# EAGLE design IB_WIFI_V2 (EAGLE 6.4)
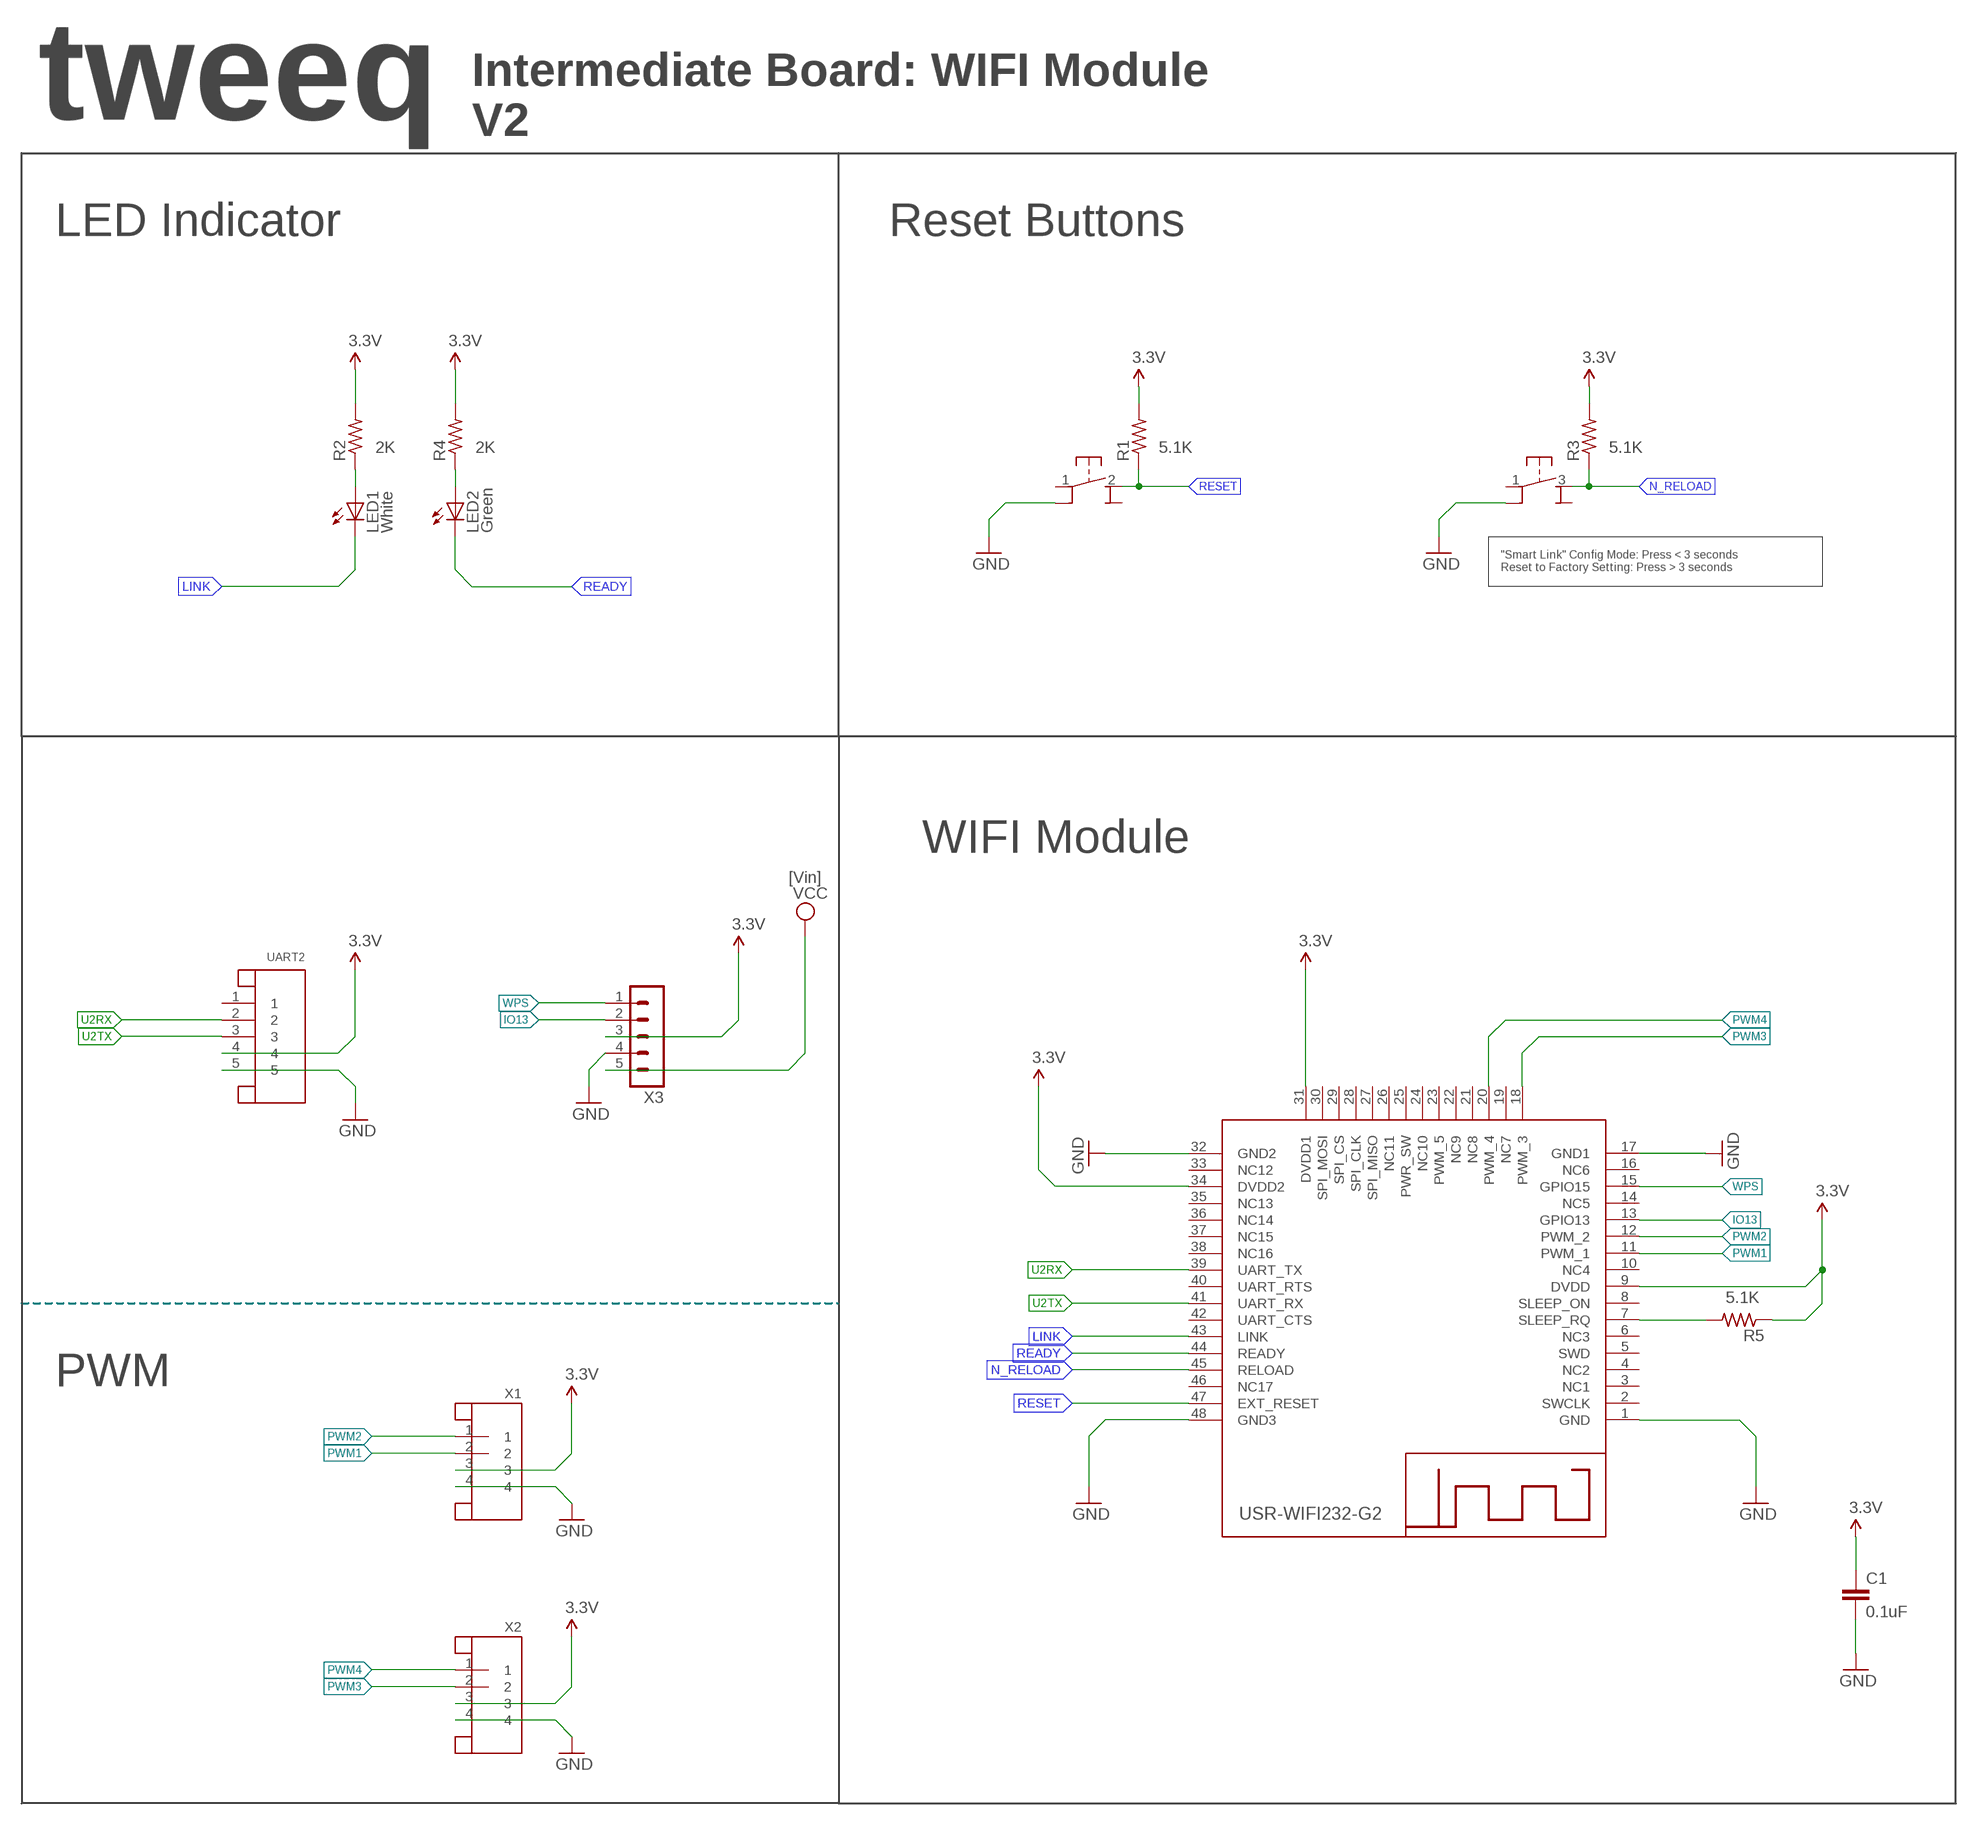
[diagram p0: schematic, sheet 1, part 1 of 2]
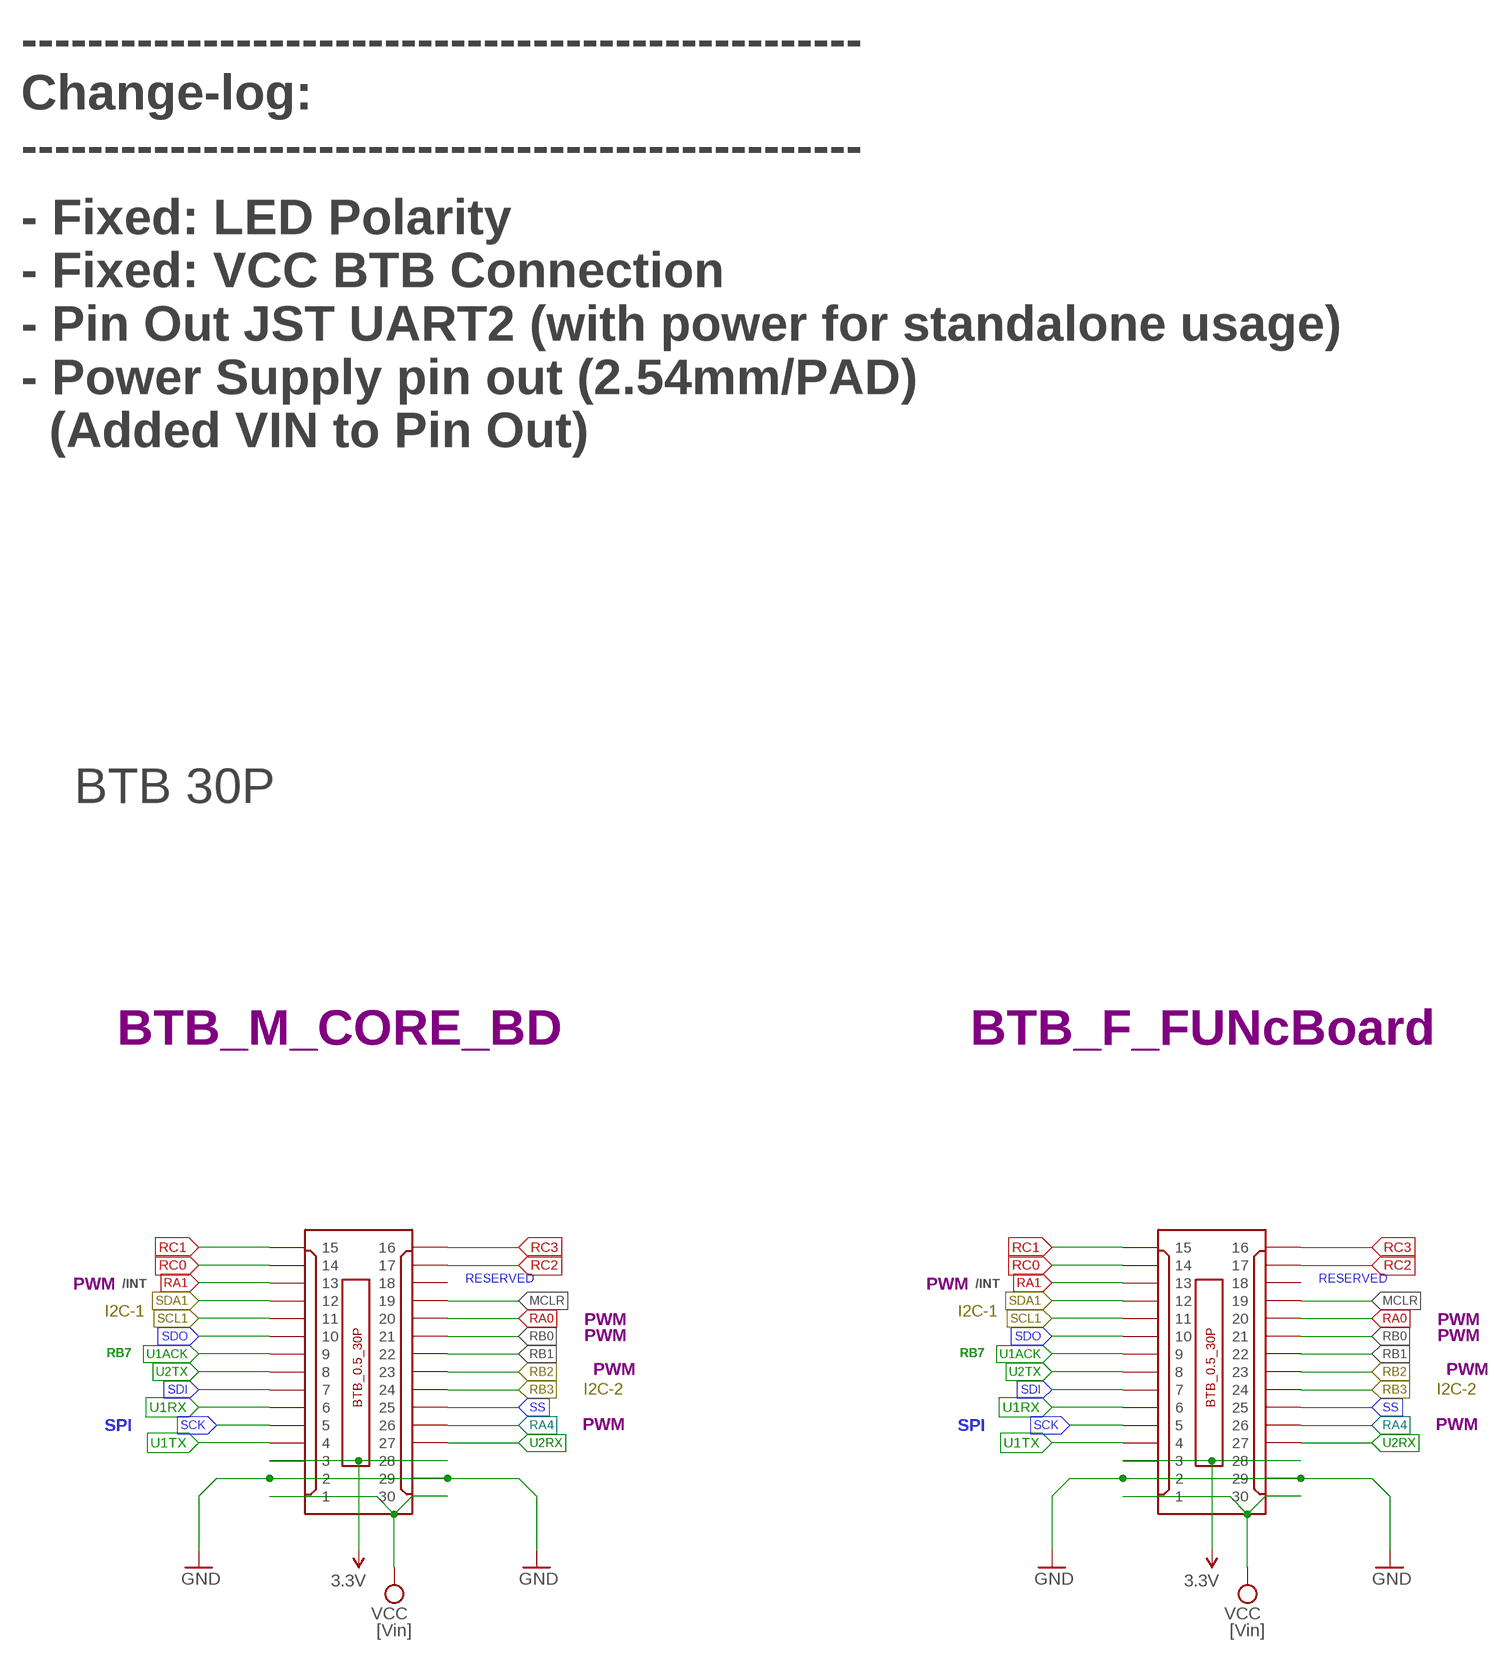
[diagram p1: schematic, sheet 1, part 2 of 2]

## Parts
C1  0.1uF  C-EUC0603  [C0603]
LED1  White  LEDCHIPLED_0805  [CHIPLED_0805]
LED2  Green  LEDCHIPLED_0805  [CHIPLED_0805]
R1  5.1K  R-US_R0603  [R0603]
R2  2K  R-US_R0603  [R0603]
R3  5.1K  R-US_R0603  [R0603]
R4  2K  R-US_R0603  [R0603]
R5  5.1K  R-US_R0603  [R0603]
U$1  BTB_CONN_30P/M  [BTB0.5-30M-3.0G]
U$3  BTB_CONN_30P/F  [BTB0.5-30F-3.0G]
U$4  PB_MICRO_SMT  [PB_SMT_3.5X3X2]
U$5  PB_MICRO_SMTRIGHTANGLE  [PB_SMT_90D6.2X4.6]
UART2  JST-5PINSH  [SH1.0-5PIN]
USR-WIFI232-G2  USR-WIFI232-G2  [USR-WIFI232-G]
X1  JST-4PINSH  [SH1.0-4PIN]
X2  JST-4PINSH  [SH1.0-4PIN]
X3  M05-1PAD  [1X05_PAD]

## Nets
3.3V: C1.1 R1.2 R2.2 R3.2 R4.2 R5.1 U$1.3 U$1.28 U$3.3 U$3.28 UART2.4 USR-WIFI232-G2.9(DVDD) USR-WIFI232-G2.31(DVDD1) USR-WIFI232-G2.34(DVDD2) X1.3 X2.3 X3.3
GND: C1.2 U$1.2 U$1.29 U$3.2 U$3.29 U$4.2(1A) U$5.1A UART2.5 USR-WIFI232-G2.1(GND) USR-WIFI232-G2.17(GND1) USR-WIFI232-G2.32(GND2) USR-WIFI232-G2.48(GND3) X1.4 X2.4 X3.4
IO13: USR-WIFI232-G2.13(GPIO13) X3.2
LINK: LED1.C USR-WIFI232-G2.43(LINK)
MCLR: U$1.19 U$3.19
N$1: LED1.A R2.1
N$2: LED2.A R4.1
N_RELOAD: R3.1 U$4.3 USR-WIFI232-G2.45(RELOAD)
PWM1: USR-WIFI232-G2.11(PWM_1) X1.2
PWM2: USR-WIFI232-G2.12(PWM_2) X1.1
PWM3: USR-WIFI232-G2.18(PWM_3) X2.2
PWM4: USR-WIFI232-G2.20(PWM_4) X2.1
RA0: U$1.20 U$3.20
RA1: U$1.13 U$3.13
RA4: U$1.26 U$3.26
RB0: U$1.21 U$3.21
RB1: U$1.22 U$3.22
RB2: U$1.23 U$3.23
RB3: U$1.24 U$3.24
RC0: U$1.14 U$3.14
RC1: U$1.15 U$3.15
RC2: U$1.17 U$3.17
RC3: U$1.16 U$3.16
READY: LED2.C USR-WIFI232-G2.44(READY)
RESET: R1.1 U$5.2 USR-WIFI232-G2.47(EXT_RESET)
SCK: U$1.5 U$3.5
SCL1: U$1.11 U$3.11
SDA1: U$1.12 U$3.12
SDI: U$1.7 U$3.7
SDO: U$1.10 U$3.10
SLEEP_RQ: R5.2 USR-WIFI232-G2.7(SLEEP_RQ)
SS: U$1.25 U$3.25
U1ACK: U$1.9 U$3.9
U1RX: U$1.6 U$3.6
U1TX: U$1.4 U$3.4
U2RX: U$1.27 U$3.27 UART2.2 USR-WIFI232-G2.39(UART_TX)
U2TX: U$1.8 U$3.8 UART2.3 USR-WIFI232-G2.41(UART_RX)
VCC: U$1.1 U$1.30 U$3.1 U$3.30 X3.5
WPS: USR-WIFI232-G2.15(GPIO15) X3.1
Unconnected: U$1.18 U$3.18 U$4.1 U$4.4(2A) U$5.1 U$5.2A UART2.1 USR-WIFI232-G2.2(SWCLK) USR-WIFI232-G2.3(NC1) USR-WIFI232-G2.4(NC2) USR-WIFI232-G2.5(SWD) USR-WIFI232-G2.6(NC3) USR-WIFI232-G2.8(SLEEP_ON) USR-WIFI232-G2.10(NC4) USR-WIFI232-G2.14(NC5) USR-WIFI232-G2.16(NC6) USR-WIFI232-G2.19(NC7) USR-WIFI232-G2.21(NC8) USR-WIFI232-G2.22(NC9) USR-WIFI232-G2.23(PWM_5) USR-WIFI232-G2.24(NC10) USR-WIFI232-G2.25(PWR_SW) USR-WIFI232-G2.26(NC11) USR-WIFI232-G2.27(SPI_MISO) USR-WIFI232-G2.28(SPI_CLK) USR-WIFI232-G2.29(SPI_CS) USR-WIFI232-G2.30(SPI_MOSI) USR-WIFI232-G2.33(NC12) USR-WIFI232-G2.35(NC13) USR-WIFI232-G2.36(NC14) USR-WIFI232-G2.37(NC15) USR-WIFI232-G2.38(NC16) USR-WIFI232-G2.40(UART_RTS) USR-WIFI232-G2.42(UART_CTS) USR-WIFI232-G2.46(NC17)

## Notes on the sheet
- Intermediate Board: WIFI Module
- tweeq
- V2
- LED Indicator | Reset Buttons
- ---------------------------------------------------
  Change-log:
  ---------------------------------------------------
- - Fixed: LED Polarity
  - Fixed: VCC BTB Connection
  - Pin Out JST UART2 (with power for standalone usage)
  - Power Supply pin out (2.54mm/PAD)
    (Added VIN to Pin Out)
- "Smart Link" Config Mode: Press < 3 seconds 
  Reset to Factory Setting: Press > 3 seconds
- WIFI Module
- BTB 30P
- [Vin]
- BTB_M_CORE_BD | BTB_F_FUNcBoard
- PWM | /INT | PWM | /INT
- RESERVED | RESERVED
- I2C-1 | I2C-1
- PWM | PWM
- PWM | PWM
- RB7 | RB7
- PWM
- PWM | PWM
- I2C-2 | I2C-2
- SPI | SPI
- PWM | PWM
- [Vin] | [Vin]

## Library data of the parts
C1 = AISCube:C-EU: CAPACITOR, European symbol
LED1 LED2 = AISCube:LED: LED OSRAM: - CHIPLED LG R971, LG N971, LY N971, LG Q971, LY Q971, LO R971, LY R971 LH N974, LH R974 LS Q976, LO Q976, LY Q976 LO Q996 - Hyper CHIPLED LW Q18S LB Q993, LB Q99A, LB R99A - SideLED LS A670, LO A670, LY A670, LG A670, LP A670 LB A673, LV A673, LT A673, LW A673 LH A674 LY A675 LS A676, LA A676, LO A676, LY A676, LW A676 LS A679, LY A679, LG A679 - Hyper Micro SIDELED® LS Y876, LA Y876, LO Y876, LY Y876 LT Y87S - SmartLED LW L88C, LW L88S LB L89C, LB L89S, LG L890 LS L89K, LO L89K, LY L89K LS L896, LA L896, LO L896, LY L896 - TOPLED LS T670, LO T670, LY T670, LG T670, LP T670 LSG T670, LSP T670, LSY T670, LOP T670, LYG T670 LG T671, LOG T671, LSG T671 LB T673, LV T673, LT T673, LW T673 LH T674 LS T676, LA T676, LO T676, LY T676, LB T676, LH T676, LSB T676, LW T676 LB T67C, LV T67C, LT T67C, LS T67K, LO T67K, LY T67K, LW E67C LS E67B, LA E67B, LO E67B, LY E67B, LB E67C, LV E67C, LT E67C LW T67C LS T679, LY T679, LG T679 LS T770, LO T770, LY T770, LG T770, LP T770 LB T773, LV T773, LT T773, LW T773 LH T774 LS E675, LA E675, LY E675, LS T675 LS T776, LA T776, LO T776, LY T776, LB T776 LHGB T686 LT T68C, LB T68C - Hyper Mini TOPLED® LB M676 - Mini TOPLED Santana® LG M470 LS M47K, LO M47K, LY M47K Source: http://www.osram.convergy.de/
R1-R5 = AISCube:R-US_: RESISTOR, American symbol
U$1 U$3 = AISCube:BTB_CONN_30P: Board to Board Connector SMD 0.5mm Pitch 30 way - Dual Side (2x15) Total Mating height: 3.0mm
U$4 U$5 = AISCube:PB_MICRO_SMT
UART2 = AISCube:JST-5PIN: JST 5 Pin
USR-WIFI232-G2 = AISCube:USR-WIFI232-G2: USR-WIFI232-G2 Low Power UART to WiFi Module FCC/CE Certified Single 3.3V Power Supply Support Internal/External Antenna Dimension: 23.1 x 32.8 x 2.7mm
X1 X2 = AISCube:JST-4PIN: JST 4 Pin
X3 = AISCube:M05-1: PIN HEADER Standard 0.1" header pin 5 pins - 1 way

## Board
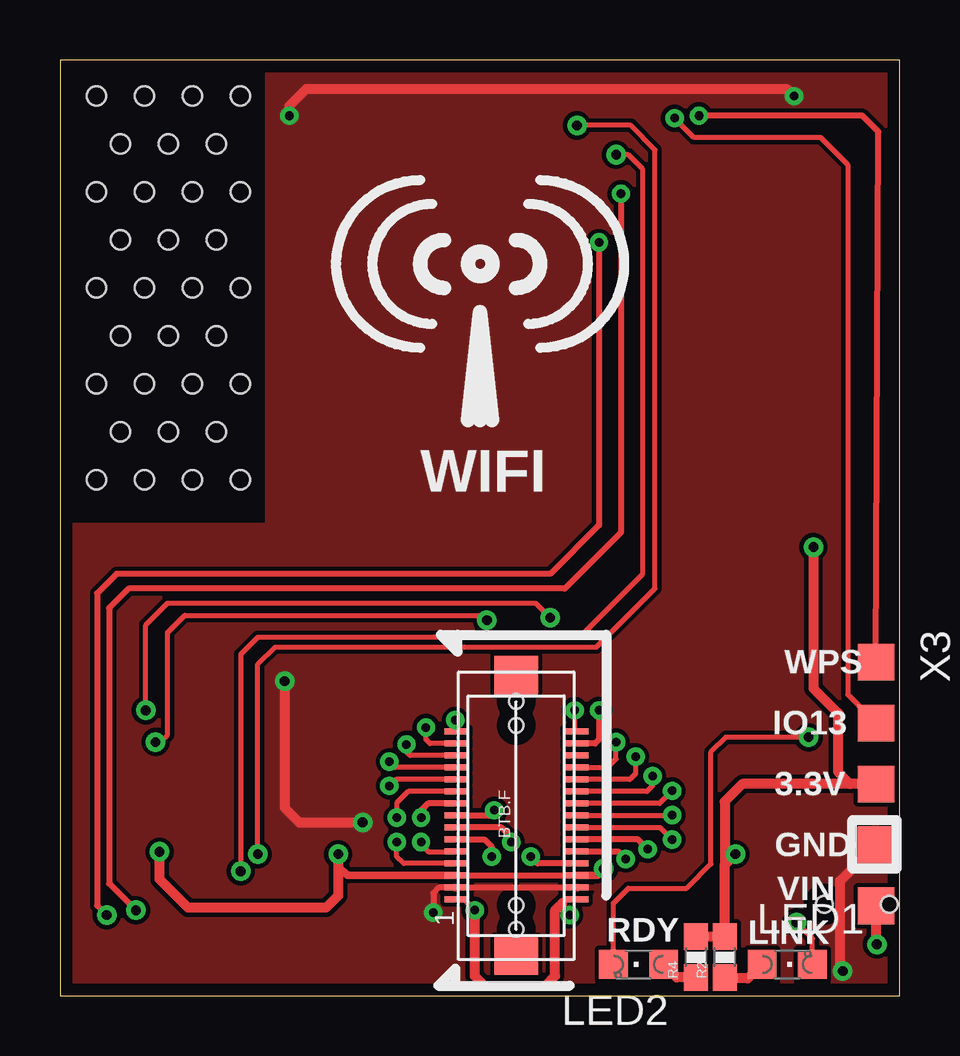
[diagram p2: board, top side]
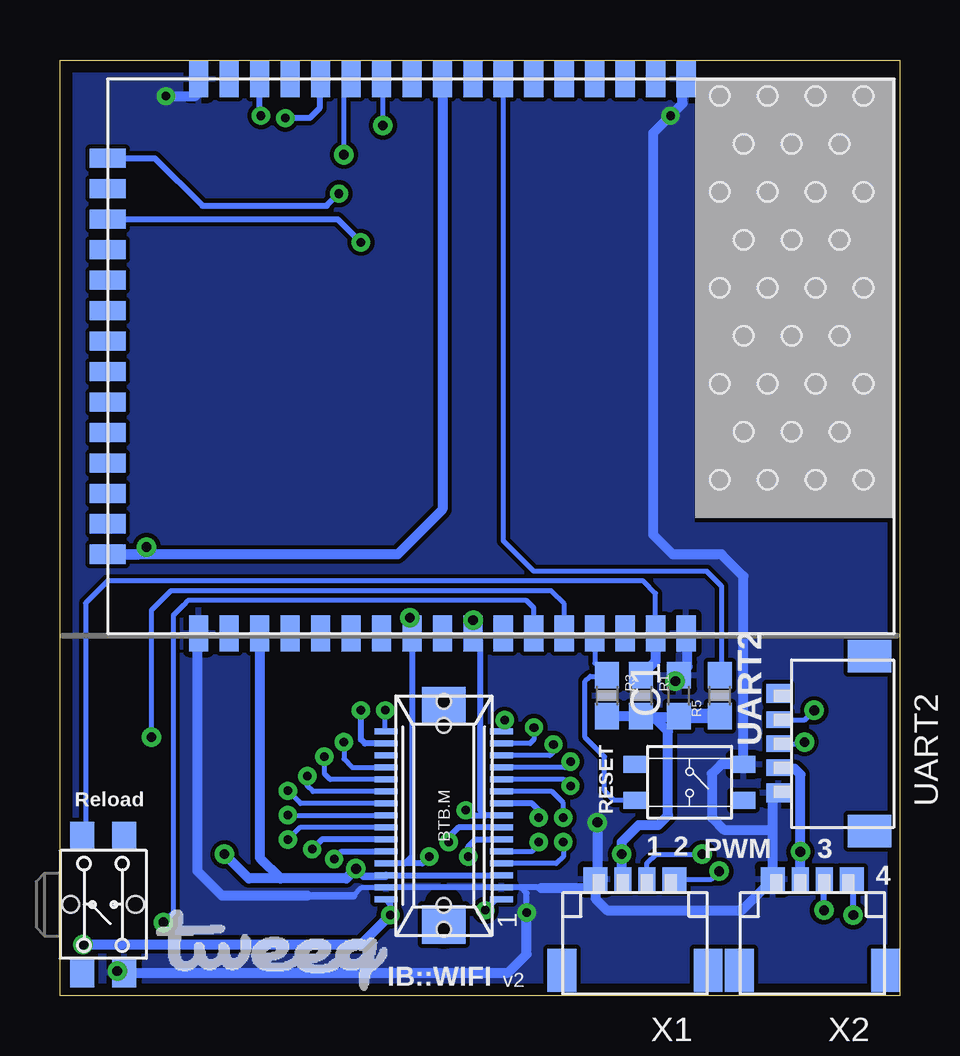
[diagram p3: board, bottom side, seen from below]

Size 35 x 39 mm. Coordinates in mm from the lower left corner, seen from the top.
Outline: 0,0 35,0 35,39 0,39 0,0
Copper layers (1*16): Top 0.0356mm / dielectric 1.5011mm / Bottom 0.0356mm
Design rules "AISCube": minimum track width 7mil, minimum drill 14mil, track to track 7mil, track to pad 7mil, pad to pad 7mil, via to via 7mil, smd to smd 0mil, copper to edge 20mil, drill to drill 8mil, minimum pad ring 10mil, minimum via ring 8mil, stop-mask expansion 4mil, vias tented up to drill 32mil, thermal gap 10mil
Holes 0.8 mm at 1.5,37.5 3.5,37.5 5.5,37.5 7.5,37.5 2.5,35.5 4.5,35.5 6.5,35.5 1.5,33.5 3.5,33.5 5.5,33.5 7.5,33.5 2.5,31.5 4.5,31.5 6.5,31.5 1.5,29.5 3.5,29.5 5.5,29.5 7.5,29.5 2.5,27.5 4.5,27.5 6.5,27.5 1.5,25.5 3.5,25.5 5.5,25.5 7.5,25.5 2.5,23.5 4.5,23.5 6.5,23.5 1.5,21.5 3.5,21.5 5.5,21.5 7.5,21.5
tKeepout: 4 lines
bKeepout: 4 lines

### Footprints (pad centres in the part's own frame; a part is rotated, then mirrored left to right if it is on the bottom)
C0603 = smd 1.1 x 1: 1 -0.85,0; 2 0.85,0
CHIPLED_0805 = smd 1.2 x 1.2: A 0,-1.05; C 0,1.05
R0603 = smd 1.1 x 1: 1 -0.85,0; 2 0.85,0
BTB0.5-30M-3.0G = smd 0.25 x 0.95: 1 -3.495,-2.41; 2 -2.995,-2.41; 3 -2.495,-2.41; 4 -1.995,-2.41; 5 -1.495,-2.41; 6 -0.995,-2.41; 7 -0.495,-2.41; 8 0.005,-2.41; 9 0.505,-2.41; 10 1.005,-2.41; 11 1.505,-2.41; 12 2.005,-2.41; 13 2.505,-2.41; 14 3.005,-2.41; 15 3.505,-2.41; 16 3.505,2.41; 17 3.005,2.41; 18 2.505,2.41; 19 2.005,2.41; 20 1.505,2.41; 21 1.005,2.41; 22 0.505,2.41; 23 0.005,2.41; 24 -0.495,2.41; 25 -0.995,2.41; 26 -1.495,2.41; 27 -1.995,2.41; 28 -2.495,2.41; 29 -2.995,2.41; 30 -3.495,2.41 | smd 1.6 x 1.8: P$1 -4.545,0; P$2 4.555,0 | hole 0.6: -3.745,0; 3.755,0
BTB0.5-30F-3.0G = smd 0.25 x 1: 1 -3.495,2.49; 2 -2.995,2.49; 3 -2.495,2.49; 4 -1.995,2.49; 5 -1.495,2.49; 6 -0.995,2.49; 7 -0.495,2.49; 8 0.005,2.49; 9 0.505,2.49; 10 1.005,2.49; 11 1.505,2.49; 12 2.005,2.49; 13 2.505,2.49; 14 3.005,2.49; 15 3.505,2.49; 16 3.505,-2.51; 17 3.005,-2.51; 18 2.505,-2.51; 19 2.005,-2.51; 20 1.505,-2.51; 21 1.005,-2.51; 22 0.505,-2.51; 23 0.005,-2.51; 24 -0.495,-2.51; 25 -0.995,-2.51; 26 -1.495,-2.51; 27 -1.995,-2.51; 28 -2.495,-2.51; 29 -2.995,-2.51; 30 -3.495,-2.51 | smd 1.6 x 1.8: P$1 -5.845,0; P$2 5.855,0 | hole 0.6: -4.745,0; 4.755,0
PB_SMT_3.5X3X2 = smd 1 x 0.7: 1 -2.25,0.75; 2 2.25,0.75; 3 -2.25,-0.75; 4 2.25,-0.75
PB_SMT_90D6.2X4.6 = smd 1.2 x 1: 1 -2.85,0.875; 1A 2.85,0.875; 2 -2.85,-0.875; 2A 2.85,-0.875 | hole 0.7: 0,-1.35; 0,1.35
SH1.0-5PIN = smd 0.8 x 1: 1 -2.09,-0.55; 5 2.05,-0.55 | smd 0.7 x 1: 2 -1,-0.55; 3 0,-0.55; 4 1,-0.55 | smd 1.35 x 1.8: P$1 -3.65,3.25; P$2 3.65,3.25
USR-WIFI232-G = smd 0.8 x 1.5: 1 24.12,23.1; 2 22.85,23.1; 3 21.58,23.1; 4 20.31,23.1; 5 19.04,23.1; 6 17.77,23.1; 7 16.5,23.1; 8 15.23,23.1; 9 13.96,23.1; 10 12.69,23.1; 11 11.42,23.1; 12 10.15,23.1; 13 8.88,23.1; 14 7.61,23.1; 15 6.34,23.1; 16 5.07,23.1; 17 3.8,23.1; 32 3.8,0; 33 5.07,0; 34 6.34,0; 35 7.61,0; 36 8.88,0; 37 10.15,0; 38 11.42,0; 39 12.69,0; 40 13.96,0; 41 15.23,0; 42 16.5,0; 43 17.77,0; 44 19.04,0; 45 20.31,0; 46 21.58,0; 47 22.85,0; 48 24.12,0 | smd 1.5 x 0.8: 18 0,19.8; 19 0,18.53; 20 0,17.26; 21 0,15.99; 22 0,14.72; 23 0,13.45; 24 0,12.18; 25 0,10.91; 26 0,9.64; 27 0,8.37; 28 0,7.1; 29 0,5.83; 30 0,4.56; 31 0,3.29
SH1.0-4PIN = smd 1 x 1: 1 -1.65,-0.55; 4 1.65,-0.55 | smd 0.7 x 1: 2 -0.5,-0.55; 3 0.5,-0.55 | smd 1.2 x 1.8: P$1 -3.05,3.25; P$2 3.05,3.25
1X05_PAD = smd 1.524 x 1.524: 1 0,0; 2 2.54,0; 3 5.08,0; 4 7.62,0; 5 10.16,0

### Placement (x,y rotation side)
C1  9.2,12.5 90 bottom
LED1  30.3,1.3 270 top
LED2  24.1,1.3 90 top
R1  10.78,12.5 270 bottom
R2  27.7,1.6 90 top
R3  12.2,12.5 270 bottom
R4  26.5,1.6 90 top
R5  7.49,12.5 90 bottom
U$1  19,7.5 90 bottom
U$3  19,7.5 90 top
U$4  8.75,8.89 0 bottom
U$5  33.2,3.8 270 bottom
U$6  [TWEEQ-LOGO-M]  30.99,0.2 0 bottom
UART2  4.5,10.5 270 bottom
USR-WIFI232-G2  33.02,15.1 0 bottom
X1  11.03,4.3 180 bottom
X2  3.63,4.3 180 bottom
X3  34,13.9 270 top

### Tracks (layer width: path | path; a pad name or v marks a point on that pad's centre or on a via)
3.3V  (via drill 0.41)
  Top 0.254: U$3.3 U$3.28
  Top 0.305: U$3.3 11.96,5 11.58,5.38 | U$3.28 22.38,5 v22.66,5.28
  Top 0.406: 27.74,2.29 R2.2 | R2.2 R4.2 | v11.58,5.89 11.58,5.38 11.58,4.17 11.07,3.66 5.32,3.66 X2.3 v4.13,5.99 | R2.2 27.7,5.45 | 27.7,5.45 v28.14,5.89 | X3.3 32.92,8.82 | 32.92,8.82 28.43,8.82 27.7,8.09 27.7,5.45 | v31.39,18.69 31.39,12.8 32.41,11.79 32.41,9.33 32.92,8.82
  Bottom 0.254: 11.58,4.9 X1.3 | U$1.28 U$1.3
  Bottom 0.305: v22.66,5.28 22.35,4.98 21.44,4.98 U$1.28
  Bottom 0.406: X2.3 v4.13,5.99 4.13,9.21 4.37,9.45 5,9.45 UART2.4 | 10.26,11.62 R1.2 R3.2 | 10.26,11.62 9.23,11.62 C1.1 | 10.26,11.62 9.65,11.01 9.65,7.52 10.06,7.11 10.87,7.11 11.58,6.4 v11.58,5.89 11.58,4.9 | v22.66,5.28 23.06,4.88 25.81,4.88 | 25.81,4.88 27.13,4.88 v28.14,5.89 | USR-WIFI232-G2.34 26.68,5.75 25.81,4.88 | USR-WIFI232-G2.9 19.06,20.26 20.93,18.39 USR-WIFI232-G2.31 31.7,18.39 v31.39,18.69
  Bottom 0.61: C1.1 R5.1
GND  (via drill 0.36, 0.41)
  Top 0.254: U$3.29 U$3.2 15.78,4.5 15.54,4.27 v15.54,3.45
  Top 0.406: v9.55,36.68 9.55,37.08 10.26,37.8 30.28,37.8 v30.58,37.49 | v9.35,13.11 9.35,7.82 9.96,7.21 v12.6,7.21 | v32.61,1.02 32.51,1.12 32.51,4.79 X3.4
  Bottom 0.203: 22.76,4.17 22.42,4.5 U$1.29
  Bottom 0.254: U$1.29 U$1.2 15.78,4.5 | v15.54,3.45 15.54,4.27 15.78,4.5 | 14.94,4.47 14.97,4.5 15.78,4.5
  Bottom 0.305: 24.69,4.17 22.76,4.17
  Bottom 0.406: X1.4 13.05,4.47 14.94,4.47 | USR-WIFI232-G2.1 9.04,38.06 9.04,37.19 v9.55,36.68 10.26,35.97 10.26,19.2 9.45,18.39 7.42,18.39 6.5,17.48 U$4.2 7.43,9.64 7.82,9.25 7.82,7.42 7.32,6.91 5.38,6.91 5.28,6.81 | v30.58,37.49 29.36,37.49 29.26,37.59 29.26,38.16 USR-WIFI232-G2.17 | USR-WIFI232-G2.48 8.84,15.05 8.84,13.71 C1.2 9.2,13.26 v9.35,13.11 | 5.28,6.81 X2.4 6.57,3.56 12.19,3.56 12.68,4.04 X1.4 | 5.28,6.81 5.28,8.22 UART2.5 | v12.6,7.21 12.6,4.92 X1.4 | 32.33,1.34 v32.61,1.02 32.55,0.95 U$5.1A 16.32,0.95 15.54,1.73 v15.54,3.45 | 24.69,4.17 28.25,4.17 29.26,5.18 29.26,15.06 USR-WIFI232-G2.32
  pour Bottom: 8.64,38.81 34.85,38.81 34.85,0.2 0.2,0.2 0.2,19.61 8.64,19.61
  pour Top: 8.64,38.81 34.85,38.81 34.85,0.2 0.2,0.2 0.2,19.61 8.64,19.61
IO13  (via drill 0.36)
  Top 0.203: v25.6,36.58 26.42,35.76 31.7,35.76 32.82,34.65 32.82,12.55 X3.2
  Bottom 0.254: USR-WIFI232-G2.13 24.18,38.16 24.18,36.98 24.59,36.58 v25.6,36.58
LINK  (via drill 0.41)
  Top 0.203: LED1.C 31.35,2.38 v30.68,3.05
  Bottom 0.203: USR-WIFI232-G2.43 15.25,16.16 15.54,16.46 29.67,16.46 29.87,16.26 30.28,15.85 30.28,3.45 v30.68,3.05
MCLR  (via drill 0.36)
  Top 0.203: U$3.19 22.82,9.51 23.16,9.86 v23.16,10.57
  Bottom 0.203: v23.16,10.57 23.16,9.86 22.82,9.51 U$1.19
N$1
  Top 0.406: LED1.A 29.24,1.3 28.65,0.71 27.74,0.71 R2.1
N$2
  Top 0.406: R4.1 25.69,0.75 LED2.A
N_RELOAD
  Bottom 0.203: U$4.3 11.9,8.14 12.29,8.53 12.29,9.96 13.11,10.77 13.11,13.11 12.9,13.31 12.24,13.31 R3.1 12.71,13.86 USR-WIFI232-G2.45
PWM1  (via drill 0.41)
  Top 0.203: v8.23,5.89 8.23,13.82 8.94,14.53 22.35,14.53 24.79,16.97 24.79,35.26 23.77,36.27 v21.54,36.27
  Bottom 0.203: X1.2 10.53,5.53 10.16,5.89 v8.23,5.89 | v21.54,36.27 21.54,38.15 USR-WIFI232-G2.11
PWM2  (via drill 0.41)
  Top 0.203: v23.16,35.05 23.67,35.05 24.28,34.44 24.28,17.58 21.64,14.94 8.23,14.94 7.52,14.22 v7.52,5.18
  Bottom 0.203: X1.1 7.85,4.85 v7.52,5.18 | v23.16,35.05 23.16,37.91 USR-WIFI232-G2.12
PWM3  (via drill 0.36, 0.41)
  Top 0.254: v23.37,33.43 23.37,19.3 21.03,16.97 2.85,16.97 2.03,16.15 2.03,4.67 v3.15,3.56
  Bottom 0.254: USR-WIFI232-G2.18 31.04,34.9 29.06,32.92 23.88,32.92 v23.37,33.43 | v3.15,3.56 3.15,4.83 X2.2
PWM4  (via drill 0.36, 0.41)
  Top 0.254: v22.45,31.39 22.45,19.61 20.42,17.58 2.34,17.58 1.52,16.76 1.52,3.76 v1.93,3.35
  Bottom 0.254: USR-WIFI232-G2.20 23.42,32.36 v22.45,31.39 | v1.93,3.35 1.93,4.79 X2.1
RA0  (via drill 0.36)
  Top 0.203: v23.98,9.96 23.98,9.25 23.74,9.01 U$3.20
  Bottom 0.203: U$1.20 23.74,9.01 23.98,9.25 v23.98,9.96
RA1  (via drill 0.36)
  Top 0.203: U$3.13 14.58,10.01 14.43,10.16 v14.43,10.46
  Bottom 0.203: v14.43,10.46 14.43,10.16 14.58,10.01 U$1.13
RA4  (via drill 0.36)
  Top 0.254: U$3.26 23.26,6 v23.57,5.69
  Bottom 0.254: U$1.26 23.26,6 v23.57,5.69
RB0  (via drill 0.36)
  Top 0.203: v24.69,9.14 24.69,8.74 24.46,8.51 U$3.21
  Bottom 0.203: U$1.21 24.46,8.51 24.69,8.74 v24.69,9.14
RB1  (via drill 0.36)
  Top 0.203: U$3.22 24.97,8.01 v25.5,8.53
  Bottom 0.203: U$1.22 24.97,8.01 v25.5,8.53
RB2  (via drill 0.36)
  Top 0.203: U$3.23 25.49,7.5 v25.5,7.52
  Bottom 0.203: U$1.23 25.49,7.5 v25.5,7.52
RB3  (via drill 0.36)
  Top 0.203: U$3.24 25,7 v25.5,6.5
  Bottom 0.203: U$1.24 25,7 v25.5,6.5
RC0  (via drill 0.36)
  Top 0.203: U$3.14 15.4,10.51 15.24,10.67 v15.24,11.18
  Bottom 0.203: v15.24,11.18 15.24,10.67 15.4,10.51 U$1.14
RC1  (via drill 0.36)
  Top 0.203: U$3.15 16.46,11.06 v16.46,11.48
  Bottom 0.203: v16.46,11.48 16.46,11.14 U$1.15
RC2  (via drill 0.36)
  Top 0.254: v22.45,11.89 22.45,10.67 22.29,10.51 U$3.17
  Bottom 0.254: U$1.17 22.29,10.51 22.45,10.67 v22.45,11.89
RC3  (via drill 0.36)
  Top 0.203: v21.44,11.89 21.44,11.08 U$3.16
  Bottom 0.203: U$1.16 21.44,11.03 v21.44,11.89
READY  (via drill 0.41)
  Top 0.203: LED2.C 23.05,3.85 23.67,4.47 26.11,4.47 27.13,5.49 27.13,10.16 27.74,10.77 v31.19,10.77
  Bottom 0.203: USR-WIFI232-G2.44 13.98,16.31 14.53,16.87 30.38,16.87 31.19,16.05 v31.19,10.77
RESET
  Bottom 0.203: USR-WIFI232-G2.47 10.17,16.77 10.67,17.27 33.02,17.27 33.93,16.36 33.93,6.79 U$5.2
  Bottom 0.406: USR-WIFI232-G2.47 10.17,13.93 R1.1
SCK  (via drill 0.36)
  Top 0.203: v15.04,6.4 15.04,6.3 15.34,5.99 16.5,5.99 U$3.5
  Bottom 0.203: U$1.5 15.33,6 15.04,6.3 v15.04,6.4
SCL1  (via drill 0.36)
  Top 0.203: U$3.11 13.98,9.01 v13.72,8.74
  Bottom 0.203: v13.72,8.74 13.98,9.01 U$1.11
SDA1  (via drill 0.36)
  Top 0.203: U$3.12 13.96,9.51 v13.72,9.75
  Bottom 0.203: v13.72,9.75 13.96,9.51 U$1.12
SDI  (via drill 0.36)
  Top 0.254: v18.8,6.4 18.8,6.6 18.39,7.01 U$3.7
  Bottom 0.254: U$1.7 18.39,7 18.8,6.6 v18.8,6.4
SDO  (via drill 0.36)
  Top 0.203: U$3.10 14.5,8.51 14.02,8.03 v14.02,7.42
  Bottom 0.203: v14.02,7.42 14.02,8.03 14.5,8.51 U$1.10
SLEEP_RQ
  Bottom 0.203: R5.2 7.42,13.43 7.42,17.07 8.03,17.68 15.24,17.68 16.52,18.95 USR-WIFI232-G2.7
SS  (via drill 0.36)
  Top 0.254: U$3.25 24.08,6.5 v24.49,6.1
  Bottom 0.254: U$1.25 24.08,6.5 v24.49,6.1
U1ACK  (via drill 0.36)
  Top 0.254: U$3.9 15.32,8.01 15.04,7.72 v15.04,7.42
  Bottom 0.254: v15.04,7.42 15.04,7.72 15.32,8.01 U$1.9
U1RX  (via drill 0.36)
  Top 0.254: U$3.6 17.68,6.5 17.98,6.2 v17.98,5.79
  Bottom 0.254: v17.98,5.79 17.98,6.2 17.68,6.5 U$1.6
U1TX  (via drill 0.36)
  Top 0.203: U$3.4 14.31,5.5 14.02,5.79 v14.02,6.4
  Bottom 0.203: v14.02,6.4 14.02,5.79 14.31,5.5 U$1.4
U2RX  (via drill 0.36, 0.41)
  Top 0.203: v3.56,11.89 3.56,15.44 4.47,16.36 19.81,16.36 v20.42,15.75
  Top 0.254: U$3.27 19.89,5.5 v19.61,5.79
  Bottom 0.203: UART2.2 3.94,11.5 v3.56,11.89 | v20.42,15.75 20.42,15.2 USR-WIFI232-G2.39
  Bottom 0.254: v19.61,5.79 19.89,5.5 20.62,5.5 | 20.62,5.5 U$1.27 | USR-WIFI232-G2.39 20.33,5.8 20.62,5.5
U2TX  (via drill 0.36, 0.41)
  Top 0.203: v3.96,10.57 4.17,10.57 4.47,10.87 4.47,15.14 5.18,15.85 17.58,15.85 v17.78,15.65
  Top 0.254: U$3.8 17.87,7.5 v18.09,7.72
  Bottom 0.203: UART2.3 4.03,10.5 v3.96,10.57 | v17.78,15.65 USR-WIFI232-G2.41
  Bottom 0.254: U$1.8 17.26,7.5 | 17.26,7.5 17.48,7.72 17.48,14.79 USR-WIFI232-G2.41 | v18.09,7.72 17.87,7.5 17.26,7.5
VCC  (via drill 0.36, 0.41)
  Top 0.254: v17.27,3.56 16.82,4 U$3.1 | 20.83,3.76 20.93,3.86 21.07,4 U$3.30
  Top 0.406: v17.27,3.56 17.27,0.81 17.68,0.41 20.22,0.41 20.62,0.81 20.62,3.56 20.83,3.76 | v21.23,3.35 20.93,3.66 20.93,3.86 | X3.5 34,2.1 v34.04,2.13
  Bottom 0.254: U$1.1 16.82,4 v17.27,3.56 | U$1.30 21.23,3.83 v21.23,3.35
  Bottom 0.406: v34.04,2.13 22.45,2.13 v21.23,3.35
WPS  (via drill 0.36)
  Top 0.254: X3.1 34.1,36 33.43,36.68 v26.62,36.68
  Bottom 0.254: v26.62,36.68 26.68,36.73 USR-WIFI232-G2.15

### Text on the board
tPlace: WIFI | WPS | IO13 | 3.3V | GND | VIN | RDY | LINK
bPlace: UART2 | RESET | Reload | 3 | PWM | 2 | 1 | 4 | v2 | IB::WIFI